# Altium schematic sheet Sheet9.SchDoc
size A4
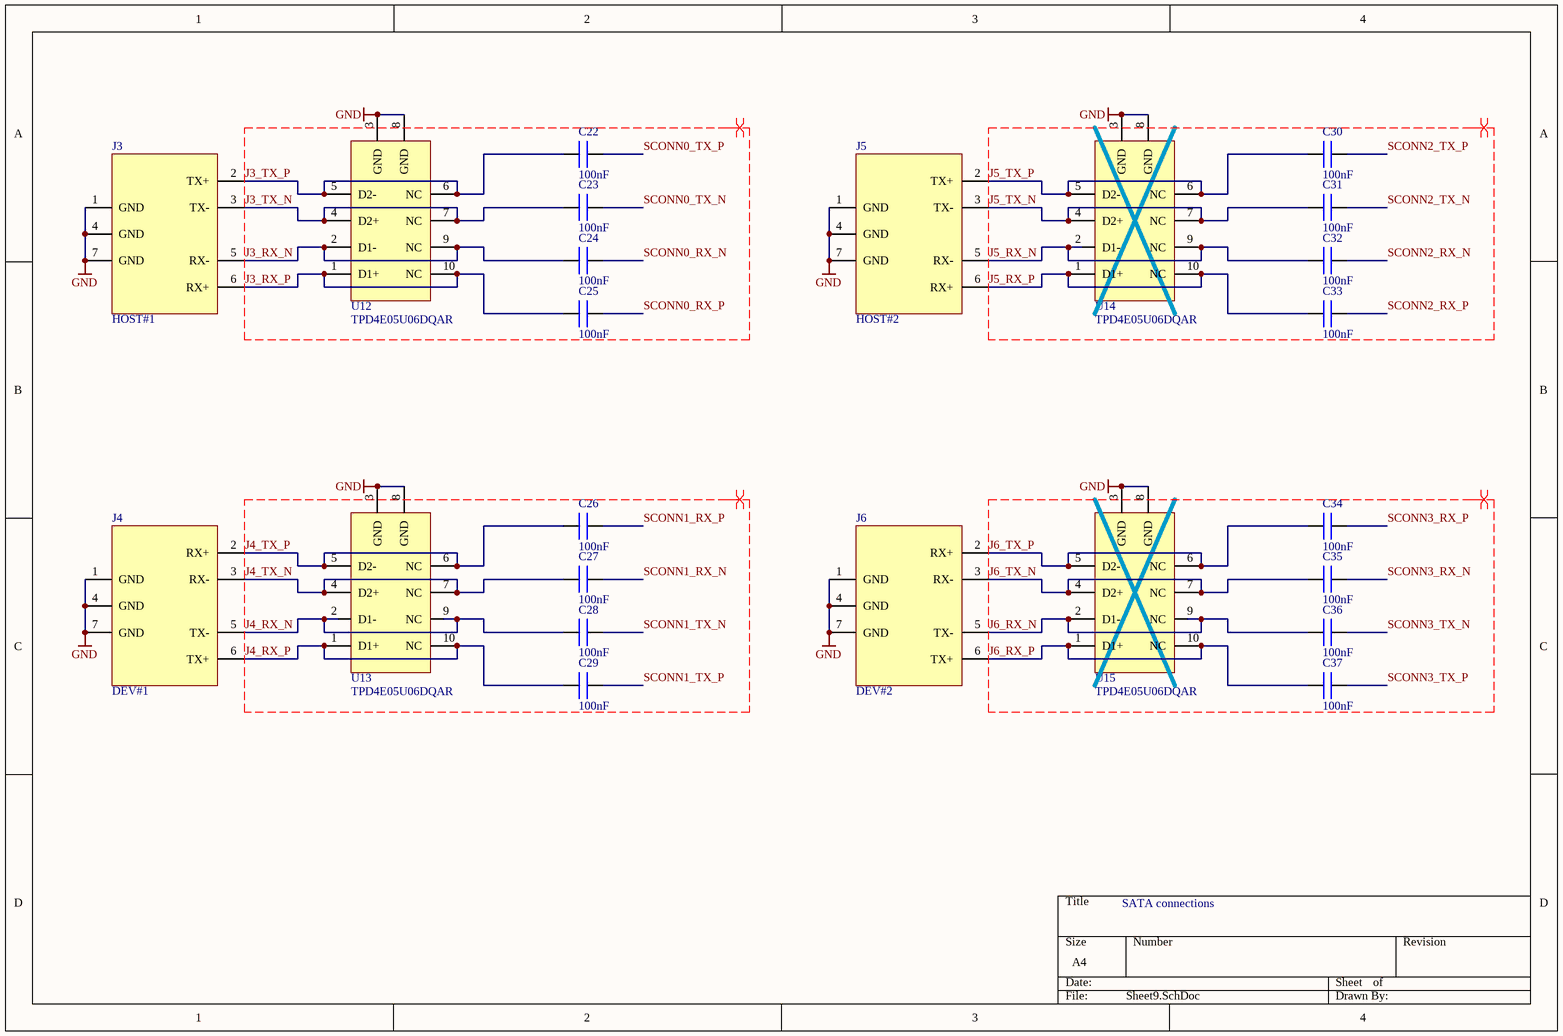
[diagram p0: Sheet9.SchDoc]

## Parts
C22  100nF  [CAPC1005X05N]
C23  100nF  [CAPC1005X05N]
C24  100nF  [CAPC1005X05N]
C25  100nF  [CAPC1005X05N]
C26  100nF  [CAPC1005X05N]
C27  100nF  [CAPC1005X05N]
C28  100nF  [CAPC1005X05N]
C29  100nF  [CAPC1005X05N]
C30  100nF  [CAPC1005X05N]
C31  100nF  [CAPC1005X05N]
C32  100nF  [CAPC1005X05N]
C33  100nF  [CAPC1005X05N]
C34  100nF  [CAPC1005X05N]
C35  100nF  [CAPC1005X05N]
C36  100nF  [CAPC1005X05N]
C37  100nF  [CAPC1005X05N]
J3  HOST#1  [5607-4200-SH]
J4  DEV#1  [5607-4200-SH]
J5  HOST#2  [5607-4200-SH]
J6  DEV#2  [5607-4200-SH]
U12  TPD4E05U06DQAR  [TPD4E05U06DQAR]
U13  TPD4E05U06DQAR  [TPD4E05U06DQAR]
U14  TPD4E05U06DQAR  [TPD4E05U06DQAR]
U15  TPD4E05U06DQAR  [TPD4E05U06DQAR]

## Nets
GND: J3.1(GND) J3.4(GND) J3.7(GND) J4.1(GND) J4.4(GND) J4.7(GND) J5.1(GND) J5.4(GND) J5.7(GND) J6.1(GND) J6.4(GND) J6.7(GND) U12.3(GND) U12.8(GND) U13.3(GND) U13.8(GND) U14.3(GND) U14.8(GND) U15.3(GND) U15.8(GND)
J3_RX_N: C24.2 J3.5(RX-) U12.2(D1-) U12.9(NC)
J3_RX_P: C25.2 J3.6(RX+) U12.1(D1+) U12.10(NC)
J3_TX_N: C23.2 J3.3(TX-) U12.4(D2+) U12.7(NC)
J3_TX_P: C22.2 J3.2(TX+) U12.5(D2-) U12.6(NC)
J4_RX_N: C28.2 J4.5(TX-) U13.2(D1-) U13.9(NC)
J4_RX_P: C29.2 J4.6(TX+) U13.1(D1+) U13.10(NC)
J4_TX_N: C27.2 J4.3(RX-) U13.4(D2+) U13.7(NC)
J4_TX_P: C26.2 J4.2(RX+) U13.5(D2-) U13.6(NC)
J5_RX_N: C32.2 J5.5(RX-) U14.2(D1-) U14.9(NC)
J5_RX_P: C33.2 J5.6(RX+) U14.1(D1+) U14.10(NC)
J5_TX_N: C31.2 J5.3(TX-) U14.4(D2+) U14.7(NC)
J5_TX_P: C30.2 J5.2(TX+) U14.5(D2-) U14.6(NC)
J6_RX_N: C36.2 J6.5(TX-) U15.2(D1-) U15.9(NC)
J6_RX_P: C37.2 J6.6(TX+) U15.1(D1+) U15.10(NC)
J6_TX_N: C35.2 J6.3(RX-) U15.4(D2+) U15.7(NC)
J6_TX_P: C34.2 J6.2(RX+) U15.5(D2-) U15.6(NC)
SCONN0_RX_N: C24.1
SCONN0_RX_P: C25.1
SCONN0_TX_N: C23.1
SCONN0_TX_P: C22.1
SCONN1_RX_N: C27.1
SCONN1_RX_P: C26.1
SCONN1_TX_N: C28.1
SCONN1_TX_P: C29.1
SCONN2_RX_N: C32.1
SCONN2_RX_P: C33.1
SCONN2_TX_N: C31.1
SCONN2_TX_P: C30.1
SCONN3_RX_N: C35.1
SCONN3_RX_P: C34.1
SCONN3_TX_N: C36.1
SCONN3_TX_P: C37.1

## Layout directives
differential pair: J3_RX_N, J3_RX_P, J3_TX_N, J3_TX_P, J4_RX_N, J4_RX_P, J4_TX_N, J4_TX_P, J5_RX_N, J5_RX_P, J5_TX_N, J5_TX_P, J6_RX_N, J6_RX_P, J6_TX_N, J6_TX_P, SCONN0_RX_N, SCONN0_RX_P, SCONN0_TX_N, SCONN0_TX_P, SCONN1_RX_N, SCONN1_RX_P, SCONN1_TX_N, SCONN1_TX_P, SCONN2_RX_N, SCONN2_RX_P, SCONN2_TX_N, SCONN2_TX_P, SCONN3_RX_N, SCONN3_RX_P, SCONN3_TX_N, SCONN3_TX_P

## Notes on the sheet
- SATA connections

## Library data of the parts
C22-C37 = C0402: Ceramic Chip Capacitor; Value: 100nF
J3 J5 = 5607-4200-SH-HOST: 3M SATA Series Connector (Host)
J4 J6 = 5607-4200-SH-DEVICE: 3M SATA Series Connector (Device)
U12-U15 = TPD4E05U06DQAR: 4-Channel ESD Protection Device for Super-Speed (Up to 6 Gbps)  Interface